# EAGLE design motores_01 (EAGLE 6.1)
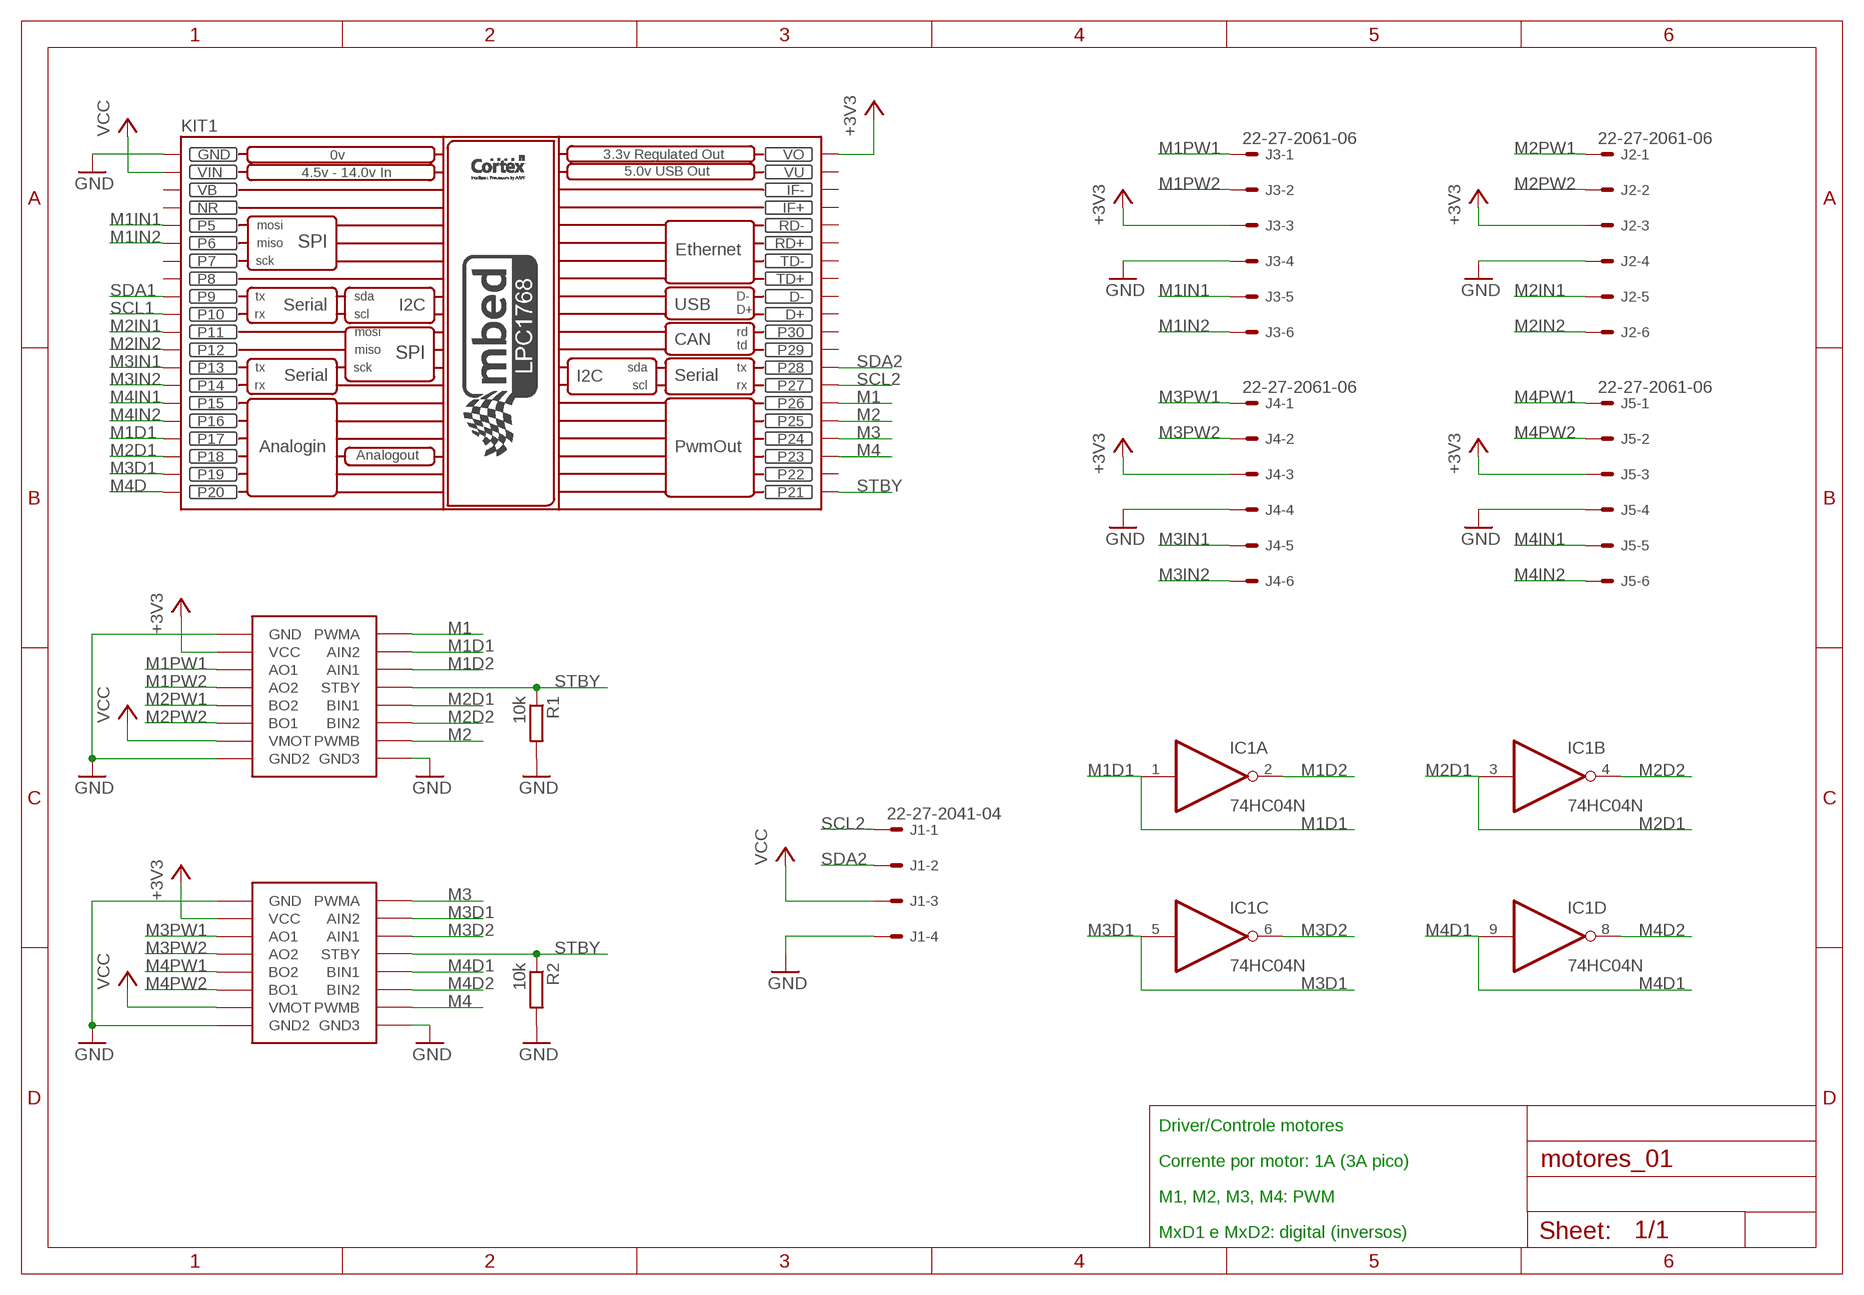
[diagram p0: schematic, sheet 1]

## Parts
IC1  74HC04N  [DIL14]
J1  22-27-2041-04  [6410-04]
J2  22-27-2061-06  [6410-06]
J3  22-27-2061-06  [6410-06]
J4  22-27-2061-06  [6410-06]
J5  22-27-2061-06  [6410-06]
KIT1  MBED_NXP_LPC1768  [MBED-KIT]
R1  10k  R-EU_0204/7  [0204/7]
R2  10k  R-EU_0204/7  [0204/7]
U$1  MOTORDRIVER  [16PH]
U$2  MOTORDRIVER  [16PH]

## Nets
+3V3: J2.3 J3.3 J4.3 J5.3 KIT1.VOUT(VO) U$1.P$2(VCC) U$2.P$2(VCC)
GND: J1.4 J2.4 J3.4 J4.4 J5.4 KIT1.GND R1.2 R2.2 U$1.P$1(GND) U$1.P$8(GND2) U$1.P$9(GND3) U$2.P$1(GND) U$2.P$8(GND2) U$2.P$9(GND3)
M1: KIT1.P$26(P26) U$1.P$16(PWMA)
M1D1: IC1.1(A:I) KIT1.P$17(P17) U$1.P$15(AIN2)
M1D2: IC1.2(A:O) U$1.P$14(AIN1)
M1IN1: J3.5 KIT1.P$5(P5)
M1IN2: J3.6 KIT1.P$6(P6)
M1PW1: J3.1 U$1.P$3(AO1)
M1PW2: J3.2 U$1.P$4(AO2)
M2: KIT1.P$25(P25) U$1.P$10(PWMB)
M2D1: IC1.3(B:I) KIT1.P$18(P18) U$1.P$12(BIN1)
M2D2: IC1.4(B:O) U$1.P$11(BIN2)
M2IN1: J2.5 KIT1.P$11(P11)
M2IN2: J2.6 KIT1.P$12(P12)
M2PW1: J2.1 U$1.P$5(BO2)
M2PW2: J2.2 U$1.P$6(BO1)
M3: KIT1.P$24(P24) U$2.P$16(PWMA)
M3D1: IC1.5(C:I) KIT1.P$19(P19) U$2.P$15(AIN2)
M3D2: IC1.6(C:O) U$2.P$14(AIN1)
M3IN1: J4.5 KIT1.P$13(P13)
M3IN2: J4.6 KIT1.P$14(P14)
M3PW1: J4.1 U$2.P$3(AO1)
M3PW2: J4.2 U$2.P$4(AO2)
M4: KIT1.P$23(P23) U$2.P$10(PWMB)
M4D: KIT1.P$20(P20)
M4D1: IC1.9(D:I) U$2.P$12(BIN1)
M4D2: IC1.8(D:O) U$2.P$11(BIN2)
M4IN1: J5.5 KIT1.P$15(P15)
M4IN2: J5.6 KIT1.P$16(P16)
M4PW1: J5.1 U$2.P$5(BO2)
M4PW2: J5.2 U$2.P$6(BO1)
SCL1: KIT1.P$10(P10)
SCL2: J1.1 KIT1.P$27(P27)
SDA1: KIT1.P$9(P9)
SDA2: J1.2 KIT1.P$28(P28)
STBY: KIT1.P$21(P21) R1.1 R2.1 U$1.P$13(STBY) U$2.P$13(STBY)
VCC: J1.3 KIT1.VIN U$1.P$7(VMOT) U$2.P$7(VMOT)
Unconnected: IC1.10(E:O) IC1.11(E:I) IC1.12(F:O) IC1.13(F:I) KIT1.D+ KIT1.D- KIT1.IF+ KIT1.IF- KIT1.P$7(P7) KIT1.P$8(P8) KIT1.P$22(P22) KIT1.P$29(P29) KIT1.P$30(P30) KIT1.RD+ KIT1.RD- KIT1.TD+ KIT1.TD-

## Notes on the sheet
- Driver/Controle motores
- Corrente por motor: 1A (3A pico)
- M1, M2, M3, M4: PWM
- MxD1 e MxD2: digital (inversos)

## Power pins joined to a net without a drawn wire
GND: IC1.7(P:GND)
NR: KIT1.NR
VB: KIT1.VB
VCC: IC1.14(P:VCC)
VU: KIT1.VU

## Library data of the parts
IC1 = 74xx-eu:74*04: Hex INVERTER
J1 = con-molex:22-?-04: CONNECTOR wire to board 2.54 mm (.1 inch) pitch header
J2-J5 = con-molex:22-?-06: CONNECTOR wire to board 2.54 mm (.1 inch) pitch header
KIT1 = MBED_v2.1:MBED_NXP_LPC1768: Mbed LPC1768 - ARM CORTEX v2.1 * Schematic symbol is now placed in eagles's default raster. *The pads diameter are suitable for routing between mbed pins * mbed pads are 0.8 mm drill diameter. --------------------------------------------- Created by: Mohamed Yousry *Alexandria, Egypt *Email: mohamed.yousry@ieeegoldegypt.org
R1 R2 = rcl:R-EU_: RESISTOR, European symbol
U$1 U$2 = Emerotecos:MOTORDRIVER: Pololu Motor Driver 1A 3A pick http://www.pololu.com/catalog/product/713

## Board
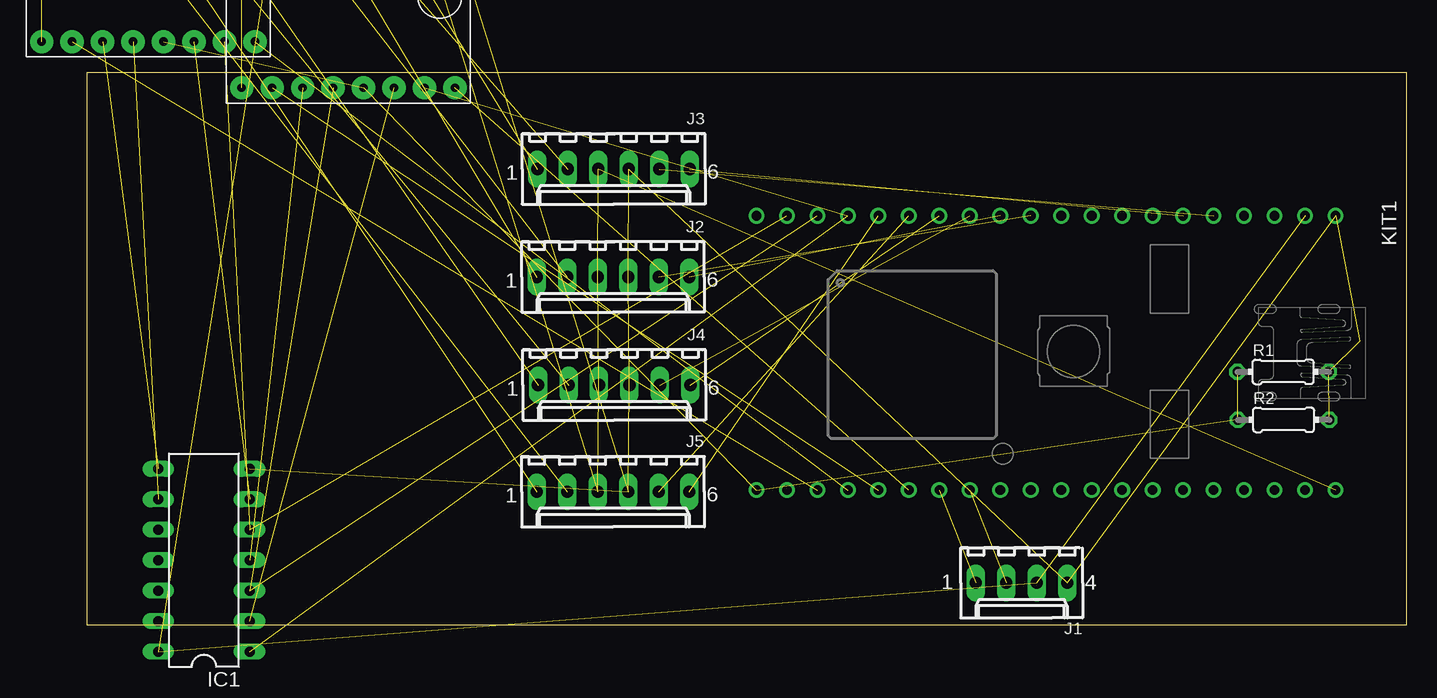
[diagram p1: board, top side]
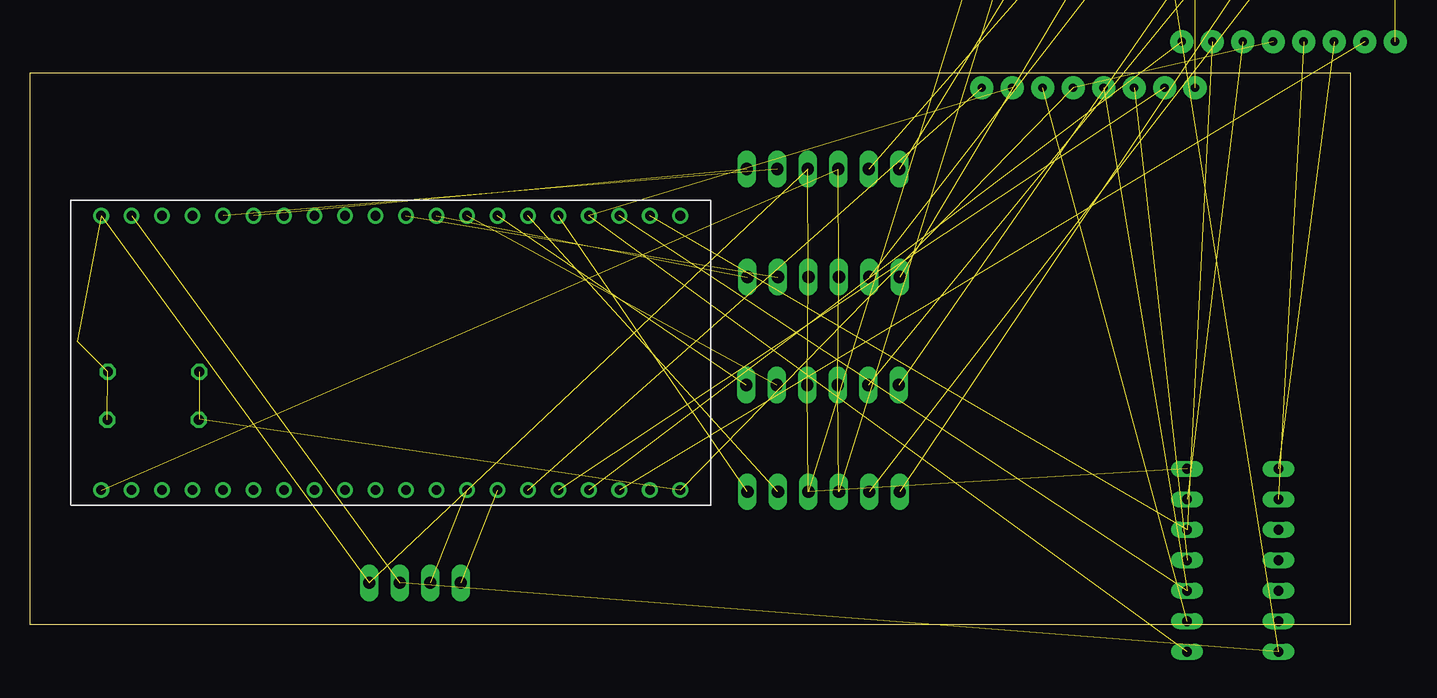
[diagram p2: board, bottom side, seen from below]

Size 110 x 46 mm. Coordinates in mm from the lower left corner, seen from the top.
Outline: 0,0 110,0 110,46 0,46 0,0
Copper layers (1*16): Top 0.035mm / dielectric 1.5mm / Bottom 0.035mm
Design rules: minimum track width 10mil, minimum drill 24mil, track to track 8mil, track to pad 8mil, pad to pad 8mil, via to via 8mil, smd to smd 8mil, copper to edge 40mil, drill to drill 8mil, minimum pad ring 10mil, minimum via ring 8mil, stop-mask expansion 4mil, vias tented up to drill 0mil, thermal gap 10mil

### Footprints (pad centres in the part's own frame; a part is rotated, then mirrored left to right if it is on the bottom)
DIL14 = drill 0.813 long: 1 -7.62,-3.81; 2 -5.08,-3.81; 3 -2.54,-3.81; 4 0,-3.81; 5 2.54,-3.81; 6 5.08,-3.81; 7 7.62,-3.81; 8 7.62,3.81; 9 5.08,3.81; 10 2.54,3.81; 11 0,3.81; 12 -2.54,3.81; 13 -5.08,3.81; 14 -7.62,3.81
6410-04 = drill 1.016 long: 1 3.81,0; 2 1.27,0; 3 -1.27,0; 4 -3.81,0
6410-06 = drill 1.016 long: 1 6.35,0; 2 3.81,0; 3 1.27,0; 4 -1.27,0; 5 -3.81,0; 6 -6.35,0
MBED-KIT = drill 0.8: D+ 11.43,1.27; D- 11.43,3.81; GND -11.43,24.13; IF+ 11.43,16.51; IF- 11.43,19.05; NR -11.43,16.51; P$5 -11.43,13.97; P$6 -11.43,11.43; P$7 -11.43,8.89; P$8 -11.43,6.35; P$9 -11.43,3.81; P$10 -11.43,1.27; P$11 -11.43,-1.27; P$12 -11.43,-3.81; P$13 -11.43,-6.35; P$14 -11.43,-8.89; P$15 -11.43,-11.43; P$16 -11.43,-13.97; P$17 -11.43,-16.51; P$18 -11.43,-19.05; P$19 -11.43,-21.59; P$20 -11.43,-24.13; P$21 11.43,-24.13; P$22 11.43,-21.59; P$23 11.43,-19.05; P$24 11.43,-16.51; P$25 11.43,-13.97; P$26 11.43,-11.43; P$27 11.43,-8.89; P$28 11.43,-6.35; P$29 11.43,-3.81; P$30 11.43,-1.27; RD+ 11.43,11.43; RD- 11.43,13.97; TD+ 11.43,6.35; TD- 11.43,8.89; VB -11.43,19.05; VIN -11.43,21.59; VOUT 11.43,24.13; VU 11.43,21.59
0204/7 = drill 0.813 octagon: 1 -3.81,0; 2 3.81,0
16PH = drill 0.8 pad 1.93 square: P$1 0,0 | drill 0.8 pad 1.93: P$2 2.54,0; P$3 5.08,0; P$4 7.62,0; P$5 10.16,0; P$6 12.7,0; P$7 15.24,0; P$8 17.78,0 | drill 0.7 pad 1.93: P$9 17.78,12.7; P$10 15.24,12.7; P$11 12.7,12.7; P$12 10.16,12.7; P$13 7.62,12.7; P$14 5.08,12.7; P$15 2.54,12.7; P$16 0,12.7

### Placement (x,y rotation side)
IC1  9.77,5.39 90 top
J1  77.91,3.5 180 top
J2  43.86,28.99 180 top
J3  43.91,37.99 180 top
J4  43.96,19.99 180 top
J5  43.86,11.1 180 top
KIT1  79.94,22.67 270 top
R1  99.7,21.09 0 top
R2  99.74,17.09 0 top
U$1  30.69,57.46 180 top
U$2  14.02,61.31 180 top

### Tracks (layer width: path | path; a pad name or v marks a point on that pad's centre or on a via)
+3V3  (6 unrouted)
GND  (15 unrouted)
M1  (1 unrouted)
M1D1  (2 unrouted)
M1D2  (1 unrouted)
M1IN1  (1 unrouted)
M1IN2  (1 unrouted)
M1PW1  (1 unrouted)
M1PW2  (1 unrouted)
M2  (1 unrouted)
M2D1  (2 unrouted)
M2D2  (1 unrouted)
M2IN1  (1 unrouted)
M2IN2  (1 unrouted)
M2PW1  (1 unrouted)
M2PW2  (1 unrouted)
M3  (1 unrouted)
M3D1  (2 unrouted)
M3D2  (1 unrouted)
M3IN1  (1 unrouted)
M3IN2  (1 unrouted)
M3PW1  (1 unrouted)
M3PW2  (1 unrouted)
M4  (1 unrouted)
M4D1  (1 unrouted)
M4D2  (1 unrouted)
M4IN1  (1 unrouted)
M4IN2  (1 unrouted)
M4PW1  (1 unrouted)
M4PW2  (1 unrouted)
SCL2  (1 unrouted)
SDA2  (1 unrouted)
STBY  (4 unrouted)
  Bottom 0.406: 95.89,17.13 R2.1
VCC  (4 unrouted)